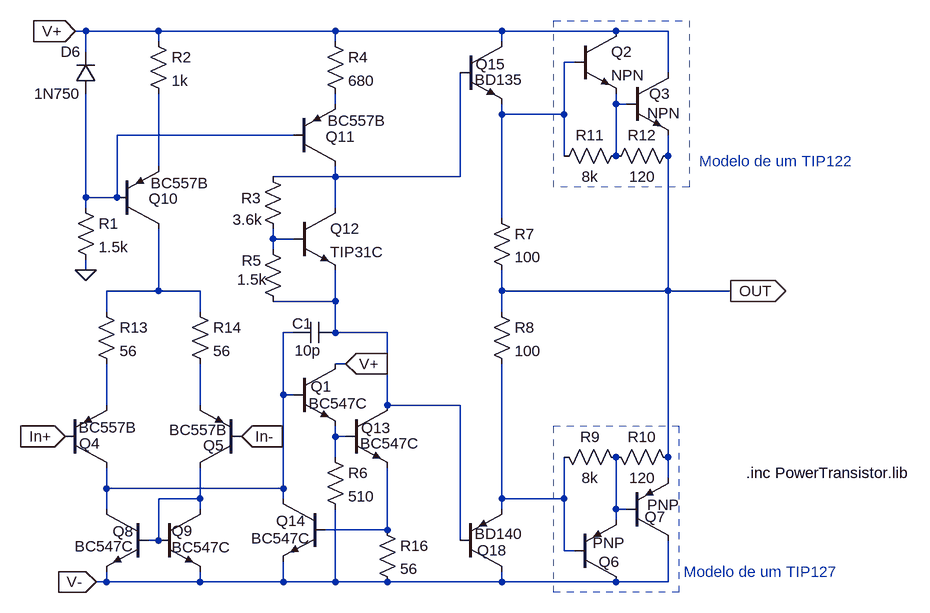
[diagram p0: schematic J_SeguidorEmissor.asc]
J_SeguidorEmissor.asc, the LTspice schematic file:
Version 4.1
SHEET 1 1452 680
WIRE -64 -464 -80 -464
WIRE 48 -464 -64 -464
WIRE 320 -464 48 -464
WIRE 576 -464 320 -464
WIRE 752 -464 576 -464
WIRE 832 -464 752 -464
WIRE 48 -448 48 -464
WIRE 320 -448 320 -464
WIRE 576 -448 576 -464
WIRE -64 -432 -64 -464
WIRE 688 -416 672 -416
WIRE 832 -400 832 -464
WIRE 320 -352 320 -368
WIRE 752 -352 752 -368
WIRE 768 -352 752 -352
WIRE 576 -336 576 -352
WIRE 672 -336 672 -416
WIRE 672 -336 576 -336
WIRE 256 -304 -16 -304
WIRE 672 -272 672 -336
WIRE 752 -272 752 -352
WIRE 832 -272 832 -304
WIRE 48 -256 48 -368
WIRE 320 -240 320 -256
WIRE 320 -240 224 -240
WIRE 512 -240 512 -400
WIRE 512 -240 320 -240
WIRE -64 -208 -64 -368
WIRE -16 -208 -16 -304
WIRE -16 -208 -64 -208
WIRE -64 -192 -64 -208
WIRE 320 -192 320 -240
WIRE 576 -176 576 -336
WIRE 224 -144 224 -160
WIRE 256 -144 224 -144
WIRE 224 -128 224 -144
WIRE -64 -96 -64 -112
WIRE 48 -64 48 -160
WIRE 48 -64 -32 -64
WIRE 112 -64 48 -64
WIRE 576 -64 576 -96
WIRE 832 -64 832 -272
WIRE 832 -64 576 -64
WIRE 928 -64 832 -64
WIRE 320 -48 320 -96
WIRE 320 -48 224 -48
WIRE -32 -32 -32 -64
WIRE 112 -32 112 -64
WIRE 576 -32 576 -64
WIRE 256 0 240 0
WIRE 320 0 320 -48
WIRE 400 0 320 0
WIRE 336 48 320 48
WIRE 240 96 240 0
WIRE 256 96 240 96
WIRE -32 112 -32 48
WIRE 112 112 112 48
WIRE 400 112 400 0
WIRE 512 112 400 112
WIRE 320 160 320 144
WIRE 336 160 320 160
WIRE 320 192 320 160
WIRE 832 192 832 -64
WIRE 832 224 832 192
WIRE -32 240 -32 208
WIRE 240 240 240 96
WIRE 240 240 -32 240
WIRE 112 256 112 208
WIRE 112 256 48 256
WIRE 240 256 240 240
WIRE 576 256 576 48
WIRE 672 256 672 192
WIRE 672 256 576 256
WIRE -32 272 -32 240
WIRE 112 272 112 256
WIRE 576 272 576 256
WIRE 752 272 752 192
WIRE 768 272 752 272
WIRE 752 288 752 272
WIRE 400 304 400 208
WIRE 400 304 304 304
WIRE 48 320 48 256
WIRE 48 320 32 320
WIRE 512 320 512 112
WIRE 672 336 672 256
WIRE 688 336 672 336
WIRE -32 384 -32 368
WIRE -32 384 -48 384
WIRE 112 384 112 368
WIRE 112 384 -32 384
WIRE 240 384 240 352
WIRE 240 384 112 384
WIRE 320 384 320 272
WIRE 320 384 240 384
WIRE 400 384 320 384
WIRE 576 384 576 368
WIRE 576 384 400 384
WIRE 752 384 576 384
WIRE 832 384 832 320
WIRE 832 384 752 384
FLAG -80 -464 V+
IOPIN -80 -464 In
FLAG -48 384 V-
IOPIN -48 384 In
FLAG -96 160 In+
IOPIN -96 160 In
FLAG 176 160 In-
IOPIN 176 160 In
FLAG 928 -64 OUT
IOPIN 928 -64 Out
FLAG -64 -96 0
FLAG 336 48 V+
IOPIN 336 48 In
SYMBOL pnp -96 208 M180
WINDOW 3 21 62 Left 2
WINDOW 0 22 37 Left 2
SYMATTR Value BC557B
SYMATTR InstName Q4
SYMBOL pnp 176 208 R180
WINDOW 3 22 58 Left 2
WINDOW 0 27 34 Left 2
SYMATTR Value BC557B
SYMATTR InstName Q5
SYMBOL res 304 -464 R0
SYMATTR InstName R4
SYMATTR Value 680
SYMBOL res 656 176 M90
WINDOW 0 0 56 VBottom 2
WINDOW 3 32 56 VTop 2
SYMATTR InstName R9
SYMATTR Value 8k
SYMBOL res 736 176 M90
WINDOW 0 0 56 VBottom 2
WINDOW 3 32 56 VTop 2
SYMATTR InstName R10
SYMATTR Value 120
SYMBOL npn 688 -464 R0
SYMATTR InstName Q2
SYMBOL npn 768 -400 R0
WINDOW 0 35 32 Left 2
WINDOW 3 32 62 Left 2
SYMATTR InstName Q3
SYMBOL res 656 -256 R270
WINDOW 0 32 56 VTop 2
WINDOW 3 0 56 VBottom 2
SYMATTR InstName R11
SYMATTR Value 8k
SYMBOL res 736 -256 R270
WINDOW 0 32 56 VTop 2
WINDOW 3 0 56 VBottom 2
SYMATTR InstName R12
SYMATTR Value 120
SYMBOL pnp 688 384 M180
WINDOW 0 37 31 Left 2
WINDOW 3 28 60 Left 2
SYMATTR InstName Q6
SYMBOL pnp 768 320 M180
WINDOW 0 28 36 Left 2
WINDOW 3 32 55 Left 2
SYMATTR InstName Q7
SYMBOL npn 256 48 R0
WINDOW 0 26 35 Left 2
WINDOW 3 23 61 Left 2
SYMATTR InstName Q1
SYMATTR Value BC547C
SYMBOL cap 320 -16 R90
WINDOW 0 18 51 VBottom 2
WINDOW 3 28 42 VTop 2
SYMATTR InstName C1
SYMATTR Value 10p
SYMBOL res -48 -48 R0
SYMATTR InstName R13
SYMATTR Value 56
SYMBOL res 96 -48 R0
SYMATTR InstName R14
SYMATTR Value 56
SYMBOL res 384 288 R0
SYMATTR InstName R16
SYMATTR Value 56
SYMBOL npn 32 272 M0
WINDOW 0 22 34 Left 2
WINDOW 3 22 57 Left 2
SYMATTR InstName Q8
SYMATTR Value BC547C
SYMBOL npn 48 272 R0
WINDOW 0 20 33 Left 2
WINDOW 3 20 59 Left 2
SYMATTR InstName Q9
SYMATTR Value BC547C
SYMBOL diode -48 -368 R180
WINDOW 0 24 64 Left 2
WINDOW 3 24 0 Left 2
SYMATTR InstName D6
SYMATTR Value 1N750
SYMBOL res -80 -208 R0
SYMATTR InstName R1
SYMATTR Value 1.5k
SYMBOL pnp -16 -160 M180
WINDOW 3 52 70 Left 2
WINDOW 0 49 46 Left 2
SYMATTR Value BC557B
SYMATTR InstName Q10
SYMBOL res 32 -464 R0
SYMATTR InstName R2
SYMATTR Value 1k
SYMBOL pnp 256 -256 M180
WINDOW 3 52 70 Left 2
WINDOW 0 49 46 Left 2
SYMATTR Value BC557B
SYMATTR InstName Q11
SYMBOL npn 256 -192 R0
SYMATTR InstName Q12
SYMATTR Value TIP31C
SYMBOL res 208 -256 R0
WINDOW 0 -33 49 Left 2
WINDOW 3 -46 82 Left 2
SYMATTR InstName R3
SYMATTR Value 3.6k
SYMBOL res 208 -144 R0
WINDOW 0 -32 33 Left 2
WINDOW 3 -39 62 Left 2
SYMATTR InstName R5
SYMATTR Value 1.5k
SYMBOL npn 336 112 R0
WINDOW 0 24 35 Left 2
WINDOW 3 22 59 Left 2
SYMATTR InstName Q13
SYMATTR Value BC547C
SYMBOL res 304 176 R0
SYMATTR InstName R6
SYMATTR Value 510
SYMBOL npn 304 256 M0
WINDOW 0 29 34 Left 2
WINDOW 3 23 61 Left 2
SYMATTR InstName Q14
SYMATTR Value BC547C
SYMBOL npn 512 -448 R0
WINDOW 0 24 35 Left 2
WINDOW 3 22 59 Left 2
SYMATTR InstName Q15
SYMATTR Value BD135
SYMBOL pnp 512 368 M180
WINDOW 3 22 58 Left 2
WINDOW 0 26 33 Left 2
SYMATTR Value BD140
SYMATTR InstName Q18
SYMBOL res 560 -192 R0
SYMATTR InstName R7
SYMATTR Value 100
SYMBOL res 560 -48 R0
SYMATTR InstName R8
SYMATTR Value 100
TEXT 880 -264 Left 2 ;Modelo de um TIP122
TEXT 856 368 Left 2 ;Modelo de um TIP127
TEXT 952 216 Left 2 !.inc PowerTransistor.lib
RECTANGLE Normal 864 -224 656 -480 2
RECTANGLE Normal 848 400 656 144 2

The netlist it stands for:
* J_SeguidorEmissor.asc
Q4 N010 In+ N011 0 BC557B
Q5 N014 In- N012 0 BC557B
R4 V+ N002 680
R9 N015 N016 8k
R10 N016 OUT 120
Q2 V+ N001 N003 0 NPN
Q3 V+ N003 OUT 0 NPN
R11 N001 N003 8k
R12 N003 OUT 120
Q6 V- N015 N016 0 PNP
Q7 V- N016 OUT 0 PNP
Q1 V+ N010 N013 0 BC547C
C1 N009 N010 10p
R13 N008 N011 56
R14 N008 N012 56
R16 N017 V- 56
Q8 N010 N014 V- 0 BC547C
Q9 N014 N014 V- 0 BC547C
D6 N004 V+ 1N750
R1 N004 0 1.5k
Q10 N008 N004 N005 0 BC557B
R2 V+ N005 1k
Q11 N006 N004 N002 0 BC557B
Q12 N006 N007 N009 0 TIP31C
R3 N006 N007 3.6k
R5 N007 N009 1.5k
Q13 N009 N013 N017 0 BC547C
R6 N013 V- 510
Q14 N010 N017 V- 0 BC547C
Q15 V+ N006 N001 0 BD135
Q18 V- N009 N015 0 BD140
R7 N001 OUT 100
R8 OUT N015 100
.model D D
.lib standard.dio
.model NPN NPN
.model PNP PNP
.lib standard.bjt
* Modelo de um TIP122
* Modelo de um TIP127
.inc PowerTransistor.lib
.backanno
.end